# EAGLE schematic picon_v0_0 (EAGLE 6.5.0)
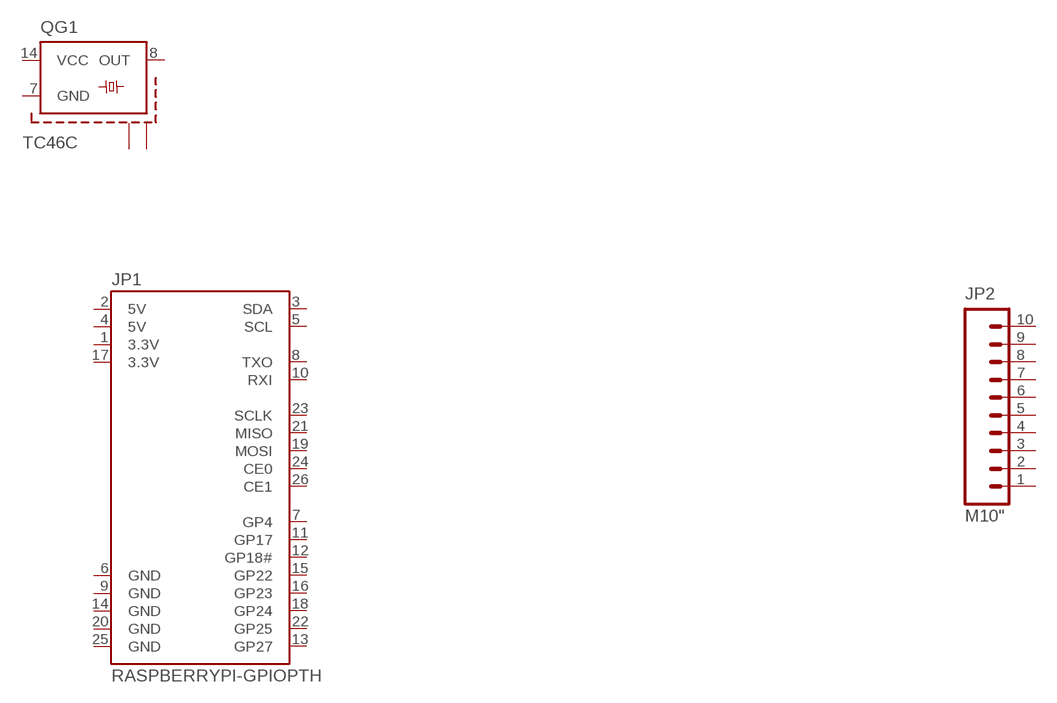
[diagram p0: schematic, sheet 1]

## Parts
JP1  RASPBERRYPI-GPIOPTH  [2X13-SHROUDED]
JP2  M10"  [1X10]
QG1  TC46C  [TC46]
Unconnected: JP1.3(SDA) JP1.5(SCL) JP1.7(GP4) JP1.8(TXO) JP1.10(RXI) JP1.11(GP17) JP1.12(GP18#) JP1.13(GP27) JP1.15(GP22) JP1.16(GP23) JP1.18(GP24) JP1.19(MOSI) JP1.21(MISO) JP1.22(GP25) JP1.23(SCLK) JP1.24(CE0) JP1.26(CE1) JP2.1 JP2.2 JP2.3 JP2.4 JP2.5 JP2.6 JP2.7 JP2.8 JP2.9 JP2.10 QG1.8(OUT) QG1.S@1(S1) QG1.S@2(S2)

## Power pins joined to a net without a drawn wire
3.3V: JP1.1(3.3V) JP1.17(3.3V)
5V: JP1.2(5V) JP1.4(5V)
GND: JP1.6(GND) JP1.9(GND) JP1.14(GND) JP1.20(GND) JP1.25(GND) QG1.7(GND)
VCC: QG1.14(VCC)

## Library data of the parts
JP1 = SparkFun-Boards:RASPBERRYPI-GPIO: RASPBERRY PI I/O HEADER As defined for the Revistion 2 Pi.; DIST: sparkfun; DIST_ID: PRT-11490
JP2 = SparkFun-Connectors:M10: Header 10 Standard 10-pin 0.1" header. Use with straight break away headers (SKU : PRT-00116), right angle break away headers (PRT-00553), swiss pins (PRT-00743), machine pins (PRT-00117), and female headers (PRT-00115).
QG1 = crystal:TC46: Temperature Compensated Xtal Oscillator HCMOS, Clipped Sine Wave or Sine Wave Compatible Source: www.pletronics.com .. tc4.pdf; OC_FARNELL: unknown; OC_NEWARK: unknown